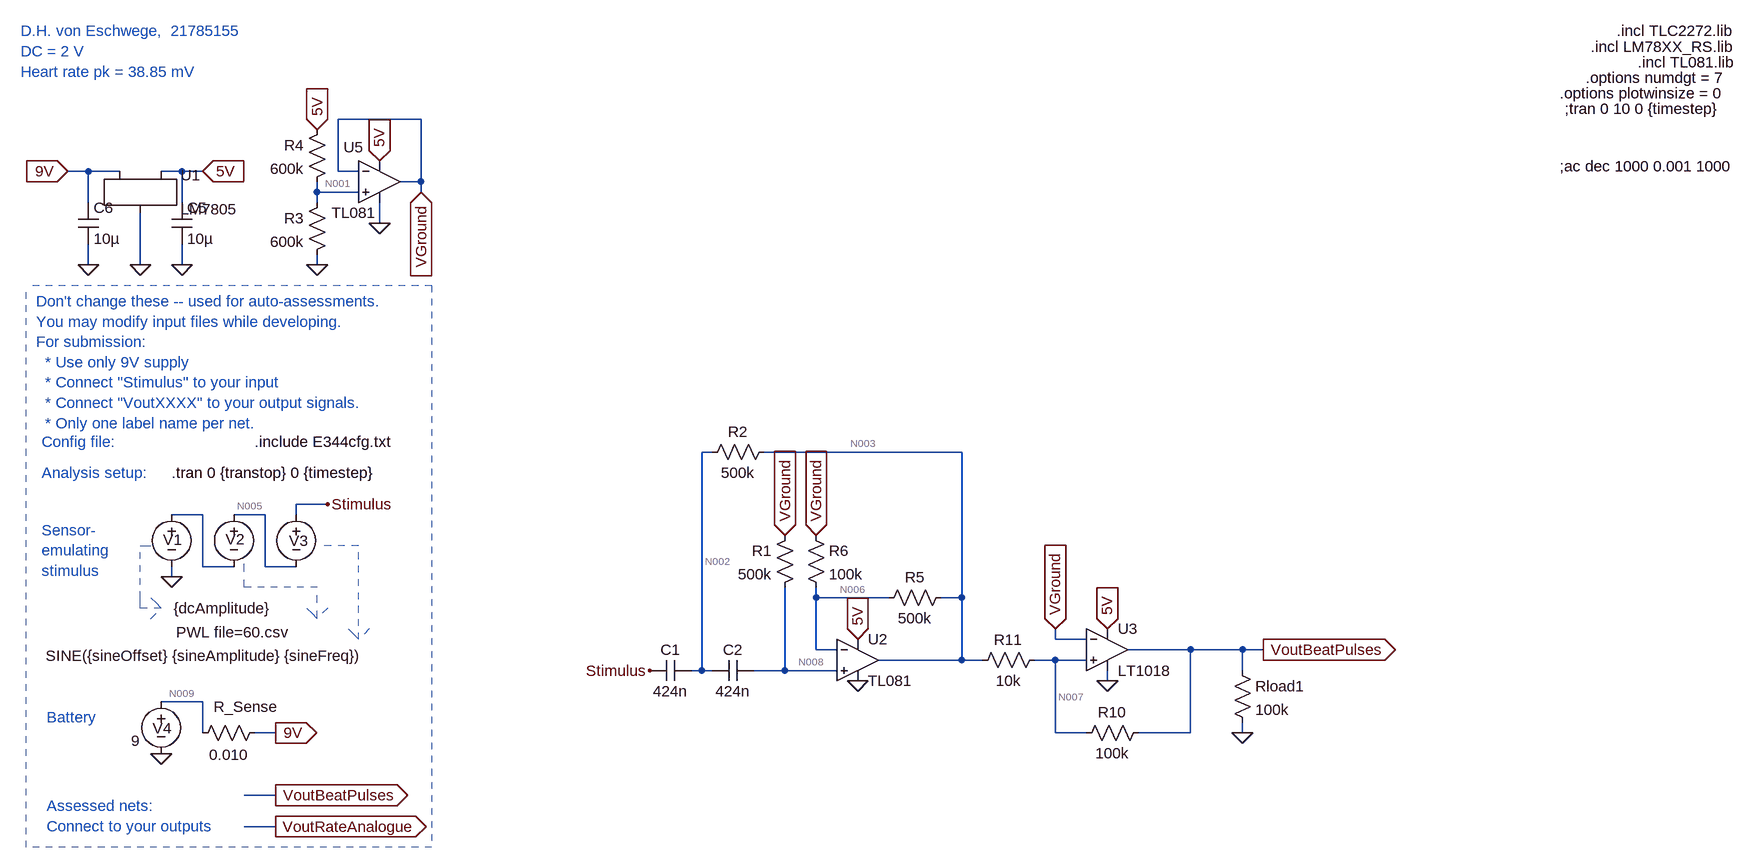
[diagram p0: schematic X_2ndOrderBPF_Schmitt - Final.asc]
X_2ndOrderBPF_Schmitt - Final.asc, the LTspice schematic file:
Version 4
SHEET 1 1824 680
WIRE -1696 -1664 -1824 -1664
WIRE -2208 -1584 -2240 -1584
WIRE -2160 -1584 -2208 -1584
WIRE -2064 -1584 -2096 -1584
WIRE -2032 -1584 -2064 -1584
WIRE -1824 -1584 -1824 -1664
WIRE -1792 -1584 -1824 -1584
WIRE -1696 -1568 -1696 -1664
WIRE -1696 -1568 -1728 -1568
WIRE -1856 -1552 -1856 -1568
WIRE -1792 -1552 -1856 -1552
WIRE -1696 -1552 -1696 -1568
WIRE -2208 -1536 -2208 -1584
WIRE -2064 -1536 -2064 -1584
WIRE -1856 -1536 -1856 -1552
WIRE -1760 -1504 -1760 -1536
WIRE -2208 -1440 -2208 -1472
WIRE -2128 -1440 -2128 -1520
WIRE -2064 -1440 -2064 -1472
WIRE -1856 -1440 -1856 -1456
WIRE -1248 -1152 -1264 -1152
WIRE -864 -1152 -1168 -1152
WIRE -1840 -1072 -1888 -1072
WIRE -2032 -1056 -2080 -1056
WIRE -1936 -1056 -1984 -1056
WIRE -1888 -1056 -1888 -1072
WIRE -2032 -976 -2032 -1056
WIRE -1984 -976 -2032 -976
WIRE -1936 -976 -1936 -1056
WIRE -1888 -976 -1936 -976
WIRE -2080 -960 -2080 -976
WIRE -1088 -928 -1088 -944
WIRE -976 -928 -1088 -928
WIRE -864 -928 -864 -1152
WIRE -864 -928 -896 -928
WIRE -720 -864 -720 -880
WIRE -672 -864 -720 -864
WIRE -1088 -848 -1088 -928
WIRE -1056 -848 -1088 -848
WIRE -512 -848 -608 -848
WIRE -432 -848 -512 -848
WIRE -400 -848 -432 -848
WIRE -864 -832 -864 -928
WIRE -864 -832 -992 -832
WIRE -832 -832 -864 -832
WIRE -720 -832 -752 -832
WIRE -672 -832 -720 -832
WIRE -1264 -816 -1264 -1152
WIRE -1264 -816 -1280 -816
WIRE -1248 -816 -1264 -816
WIRE -1136 -816 -1136 -944
WIRE -1136 -816 -1184 -816
WIRE -1056 -816 -1136 -816
WIRE -432 -816 -432 -848
WIRE -640 -800 -640 -816
WIRE -2032 -768 -2096 -768
WIRE -2032 -720 -2032 -768
WIRE -1920 -720 -1952 -720
WIRE -720 -720 -720 -832
WIRE -672 -720 -720 -720
WIRE -512 -720 -512 -848
WIRE -512 -720 -592 -720
WIRE -432 -720 -432 -736
WIRE -1920 -624 -1968 -624
WIRE -1920 -576 -1968 -576
FLAG -2080 -960 0
FLAG -1840 -1072 Stimulus
FLAG -1920 -720 9V
IOPIN -1920 -720 Out
FLAG -2096 -688 0
FLAG -1920 -624 VoutBeatPulses
IOPIN -1920 -624 Out
FLAG -1920 -576 VoutRateAnalogue
IOPIN -1920 -576 Out
FLAG -2128 -1440 0
FLAG -2240 -1584 9V
IOPIN -2240 -1584 In
FLAG -2208 -1440 0
FLAG -2064 -1440 0
FLAG -2032 -1584 5V
IOPIN -2032 -1584 In
FLAG -1856 -1440 0
FLAG -1856 -1648 5V
IOPIN -1856 -1648 In
FLAG -1760 -1504 0
FLAG -1760 -1600 5V
IOPIN -1760 -1600 In
FLAG -1696 -1552 VGround
IOPIN -1696 -1552 In
FLAG -1088 -1024 VGround
IOPIN -1088 -1024 In
FLAG -1136 -1024 VGround
IOPIN -1136 -1024 In
FLAG -1024 -800 0
FLAG -1024 -864 5V
IOPIN -1024 -864 In
FLAG -432 -720 0
FLAG -400 -848 VoutBeatPulses
IOPIN -400 -848 Out
FLAG -640 -880 5V
IOPIN -640 -880 In
FLAG -640 -800 0
FLAG -720 -880 VGround
IOPIN -720 -880 In
FLAG -1344 -816 Stimulus
SYMBOL voltage -1984 -1072 R0
WINDOW 123 0 0 Left 0
WINDOW 39 0 0 Left 0
WINDOW 3 -89 197 Left 2
WINDOW 0 -13 54 Left 2
SYMATTR Value PWL file=60.csv
SYMATTR InstName V2
SYMBOL voltage -1888 -1072 R0
WINDOW 123 24 44 Left 2
WINDOW 39 0 0 Left 0
WINDOW 3 -386 233 Left 2
WINDOW 0 -11 56 Left 2
SYMATTR Value SINE({sineOffset} {sineAmplitude} {sineFreq})
SYMATTR InstName V3
SYMBOL voltage -2080 -1072 R0
WINDOW 123 0 0 Left 0
WINDOW 39 0 0 Left 0
WINDOW 3 3 160 Left 2
WINDOW 0 -13 55 Left 2
SYMATTR Value {dcAmplitude}
SYMATTR InstName V1
SYMBOL voltage -2096 -784 R0
WINDOW 123 24 44 Left 2
WINDOW 39 0 0 Left 0
WINDOW 3 -46 76 Left 2
WINDOW 0 -13 57 Left 2
SYMATTR Value 9
SYMATTR InstName V4
SYMBOL res -1936 -736 R90
WINDOW 0 -9 30 VBottom 2
WINDOW 3 34 56 VTop 2
SYMATTR InstName R_Sense
SYMATTR Value 0.010
SYMBOL LM7805 -2128 -1568 R0
SYMATTR InstName U1
SYMBOL cap -2080 -1536 R0
SYMATTR InstName C5
SYMATTR Value 10µ
SYMBOL cap -2224 -1536 R0
SYMATTR InstName C6
SYMATTR Value 10µ
SYMBOL res -1840 -1552 M0
SYMATTR InstName R3
SYMATTR Value 600k
SYMBOL res -1840 -1664 M0
SYMATTR InstName R4
SYMATTR Value 600k
SYMBOL Opamps\\opamp2 -1760 -1632 R0
WINDOW 0 -55 11 Left 2
WINDOW 3 -74 112 Left 2
SYMATTR InstName U5
SYMATTR Value TL081
SYMBOL cap -1280 -832 R90
WINDOW 0 0 32 VBottom 2
WINDOW 3 32 32 VTop 2
SYMATTR InstName C1
SYMATTR Value 424n
SYMBOL cap -1184 -832 R90
WINDOW 0 0 32 VBottom 2
WINDOW 3 32 32 VTop 2
SYMATTR InstName C2
SYMATTR Value 424n
SYMBOL res -1120 -1040 M0
SYMATTR InstName R1
SYMATTR Value 500k
SYMBOL res -1152 -1168 R90
WINDOW 0 0 56 VBottom 2
WINDOW 3 32 56 VTop 2
SYMATTR InstName R2
SYMATTR Value 500k
SYMBOL Opamps\\opamp2 -1024 -896 R0
SYMATTR InstName U2
SYMATTR Value TL081
SYMBOL res -880 -944 R90
WINDOW 0 0 56 VBottom 2
WINDOW 3 32 56 VTop 2
SYMATTR InstName R5
SYMATTR Value 500k
SYMBOL res -1104 -1040 R0
SYMATTR InstName R6
SYMATTR Value 100k
SYMBOL res -448 -832 R0
SYMATTR InstName Rload1
SYMATTR Value 100k
SYMBOL Comparators\\LT1018 -640 -848 R0
SYMATTR InstName U3
SYMBOL res -576 -736 R90
WINDOW 0 0 56 VBottom 2
WINDOW 3 32 56 VTop 2
SYMATTR InstName R10
SYMATTR Value 100k
SYMBOL res -736 -848 R90
WINDOW 0 0 56 VBottom 2
WINDOW 3 32 56 VTop 2
SYMATTR InstName R11
SYMATTR Value 10k
TEXT -2080 -1120 Left 2 !.tran 0 {transtop} 0 {timestep}
TEXT -1952 -1168 Left 2 !.include E344cfg.txt
TEXT -2288 -1384 Left 2 ;Don't change these -- used for auto-assessments.\nYou may modify input files while developing.\nFor submission: \n  * Use only 9V supply \n  * Connect "Stimulus" to your input\n  * Connect "VoutXXXX" to your output signals.\n  * Only one label name per net.
TEXT -2280 -1168 Left 2 ;Config file:
TEXT -2280 -1120 Left 2 ;Analysis setup:
TEXT -2272 -744 Left 2 ;Battery
TEXT -2280 -1032 Left 2 ;Sensor-\nemulating \nstimulus
TEXT -2272 -608 Left 2 ;Assessed nets:\nConnect to your outputs
TEXT -2312 -1800 Left 2 ;D.H. von Eschwege,  21785155\nDC = 2 V\nHeart rate pk = 38.85 mV
TEXT 144 -1800 Left 2 !.incl TLC2272.lib
TEXT 104 -1776 Left 2 !.incl LM78XX_RS.lib
TEXT 176 -1752 Left 2 !.incl TL081.lib
TEXT 96 -1728 Left 2 !.options numdgt = 7
TEXT 56 -1704 Left 2 !.options plotwinsize = 0
TEXT 56 -1592 Left 2 !;ac dec 1000 0.001 1000
TEXT 64 -1680 Left 2 !;tran 0 10 0 {timestep}
LINE Normal -1792 -1008 -1856 -1008 2
LINE Normal -1792 -864 -1792 -1008 2
LINE Normal -1808 -880 -1792 -864 2
LINE Normal -1792 -864 -1808 -880 2
LINE Normal -1776 -880 -1792 -864 2
LINE Normal -2128 -1008 -2112 -1008 2
LINE Normal -2128 -928 -2128 -1008 2
LINE Normal -2128 -912 -2128 -928 2
LINE Normal -2096 -912 -2128 -912 2
LINE Normal -2112 -928 -2096 -912 2
LINE Normal -2096 -912 -2112 -928 2
LINE Normal -2112 -896 -2096 -912 2
LINE Normal -1968 -944 -1968 -992 2
LINE Normal -1856 -944 -1968 -944 2
LINE Normal -1856 -896 -1856 -944 2
LINE Normal -1872 -912 -1856 -896 2
LINE Normal -1856 -896 -1872 -912 2
LINE Normal -1840 -912 -1856 -896 2
LINE Normal -2304 -544 -2304 -1408 1
LINE Normal -1680 -1408 -1680 -544 1
LINE Normal -1680 -544 -2304 -544 1
LINE Normal -1680 -1408 -2304 -1408 1

The netlist it stands for:
* X_2ndOrderBPF_Schmitt - Final.asc
V2 N005 N004 PWL file=60.csv
V3 Stimulus N005 SINE({sineOffset} {sineAmplitude} {sineFreq})
V1 N004 0 {dcAmplitude}
V4 N009 0 9
R_Sense 9V N009 0.010
XU1 9V 0 5V LM7805
C5 5V 0 10µ
C6 9V 0 10µ
R3 N001 0 600k
R4 5V N001 600k
XU5 N001 VGround 5V 0 VGround TL081  ; pins In+ In- V+ V- OUT
C1 N002 Stimulus 424n
C2 N008 N002 424n
R1 VGround N008 500k
R2 N003 N002 500k
XU2 N008 N006 5V 0 N003 TL081  ; pins In+ In- V+ V- OUT
R5 N003 N006 500k
R6 VGround N006 100k
Rload1 VoutBeatPulses 0 100k
XU3 N007 VGround 5V 0 VoutBeatPulses LT1018  ; pins In+ In- V+ V- OUT
R10 VoutBeatPulses N007 100k
R11 N007 N003 10k
.tran 0 {transtop} 0 {timestep}
.include E344cfg.txt
* Don't change these -- used for auto-assessments.
* You may modify input files while developing.
* For submission:
*   * Use only 9V supply
*   * Connect "Stimulus" to your input
*   * Connect "VoutXXXX" to your output signals.
*   * Only one label name per net.
* Config file:
* Analysis setup:
* Battery
* Sensor-
* emulating
* stimulus
* Assessed nets:
* Connect to your outputs
* D.H. von Eschwege,  21785155
* DC = 2 V
* Heart rate pk = 38.85 mV
.incl TLC2272.lib
.incl LM78XX_RS.lib
.incl TL081.lib
.options numdgt = 7
.options plotwinsize = 0
;ac dec 1000 0.001 1000
;tran 0 10 0 {timestep}
.lib LTC1.lib
.backanno
.end

* Results of the author's LTspice run, read from the files saved beside the schematic
* Operating Point, zero values left out:
*   V(n005) = 2.004 V
*   V(stimulus) = 2.004 V
*   V(n009) = 9 V
*   V(9v) = 9 V
*   V(5v) = 5.003 V
*   V(n001) = 2.501 V
*   V(vground) = 2.501 V
*   V(n002) = 2.501 V
*   V(n008) = 2.501 V
*   V(n003) = 2.501 V
*   V(n006) = 2.501 V
*   V(voutbeatpulses) = 26.71 mV
*   V(n007) = 2.276 V
*   I(R11) = -22.5 µA
*   I(R10) = -22.5 µA
*   I(Rload1) = 267.1 nA
*   I(R6) = 53.36 pA
*   I(R5) = -20.8 pA
*   I(R1) = 32.55 pA
*   I(R4) = 4.169 µA
*   I(R3) = 4.169 µA
*   I(R_sense) = -10.26 mA
*   I(V4) = -10.26 mA